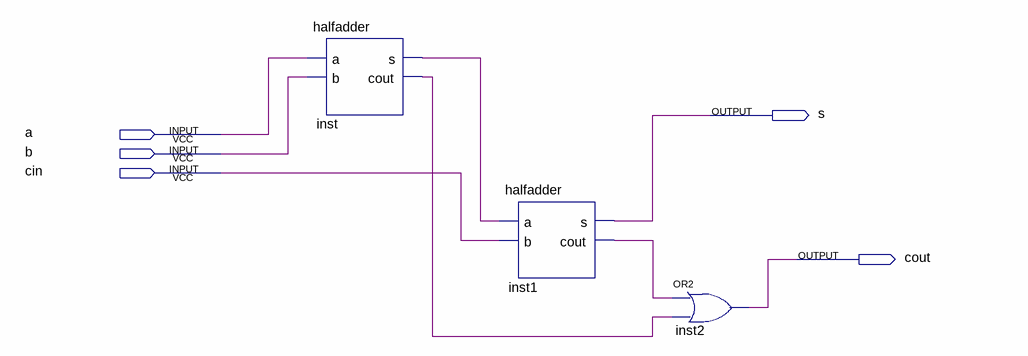
[diagram p0: schematic sheet]
// Quartus schematic fulladder.bdf as structural Verilog: 3 symbols, 5 pins
module fulladder (
  input  a,
  input  b,
  input  cin,
  output s,
  output cout
);

  wire inst1_cout, inst_cout, inst_s;

  halfadder inst (.a(a), .b(b), .s(inst_s), .cout(inst_cout));
  halfadder inst1 (.a(inst_s), .b(cin), .s(s), .cout(inst1_cout));
  or inst2 (cout, inst1_cout, inst_cout);
endmodule
